# Altium schematic sheet OBC_EBI_D-Latch.SchDoc: EBI / D-Latch
size A4; SheetNumber: 7; SheetTotal: 10
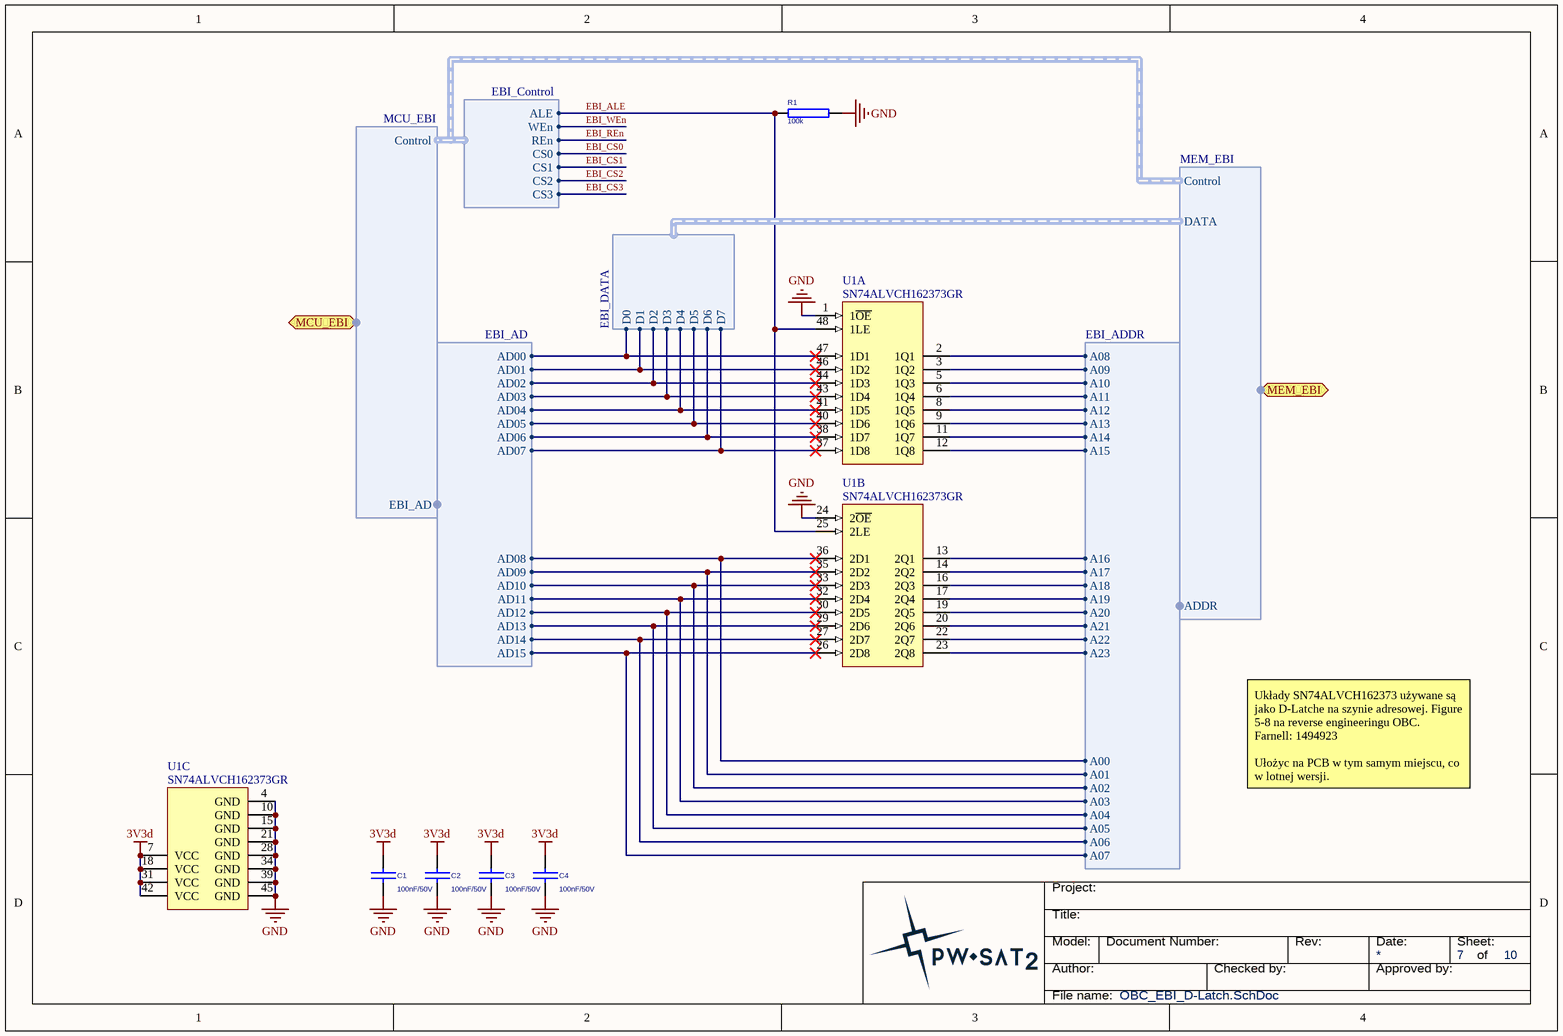
[diagram p0: OBC_EBI_D-Latch.SchDoc]

## Parts
C1  100nF/50V  [C0603]
C2  100nF/50V  [C0603]
C3  100nF/50V  [C0603]
C4  100nF/50V  [C0603]
R1  100k  [R0603]
U1  SN74ALVCH162373GR  [DGG0048A_N]  (parts A,B,C of 3)

## Ports
MCU_EBI (harness MCU_EBI), MEM_EBI (harness MEM_EBI)

## Harnesses
MCU_EBI: EBI_AD, Control
EBI_AD: AD00, AD01, AD02, AD03, AD04, AD05, AD06, AD07, AD09, AD10, AD11, AD12, AD13, AD14, AD15, AD08
MEM_EBI: DATA, ADDR, Control
EBI_ADDR: A09, A10, A11, A12, A13, A14, A15, A08, A16, A17, A18, A19, A20, A21, A22, A23, A00, A01, A02, A03, A04, A05, A06, A07
EBI_Control: ALE, WEn, REn, CS0, CS1, CS2, CS3
EBI_DATA: D6, D5, D4, D3, D2, D1, D0, D7

## Nets
3V3d: C1.1 C2.1 C3.1 C4.1 U1.7(VCC) U1.18(VCC) U1.31(VCC) U1.42(VCC)
GND: C1.2 C2.2 C3.2 C4.2 R1.1 U1.1(1~{OE}) U1.4(GND) U1.10(GND) U1.15(GND) U1.21(GND) U1.24(2~{OE}) U1.28(GND) U1.34(GND) U1.39(GND) U1.45(GND)
EBI_ALE: R1.2 U1.25(2LE) U1.48(1LE) ; harness EBI_Control.ALE
EBI_CS0: harness EBI_Control.CS0
EBI_CS1: harness EBI_Control.CS1
EBI_CS2: harness EBI_Control.CS2
EBI_CS3: harness EBI_Control.CS3
EBI_REn: harness EBI_Control.REn
EBI_WEn: harness EBI_Control.WEn
NetU1_2: U1.2(1Q1) ; harness EBI_ADDR.A08
NetU1_3: U1.3(1Q2) ; harness EBI_ADDR.A09
NetU1_5: U1.5(1Q3) ; harness EBI_ADDR.A10
NetU1_6: U1.6(1Q4) ; harness EBI_ADDR.A11
NetU1_8: U1.8(1Q5) ; harness EBI_ADDR.A12
NetU1_9: U1.9(1Q6) ; harness EBI_ADDR.A13
NetU1_11: U1.11(1Q7) ; harness EBI_ADDR.A14
NetU1_12: U1.12(1Q8) ; harness EBI_ADDR.A15
NetU1_13: U1.13(2Q1) ; harness EBI_ADDR.A16
NetU1_14: U1.14(2Q2) ; harness EBI_ADDR.A17
NetU1_16: U1.16(2Q3) ; harness EBI_ADDR.A18
NetU1_17: U1.17(2Q4) ; harness EBI_ADDR.A19
NetU1_19: U1.19(2Q5) ; harness EBI_ADDR.A20
NetU1_20: U1.20(2Q6) ; harness EBI_ADDR.A21
NetU1_22: U1.22(2Q7) ; harness EBI_ADDR.A22
NetU1_23: U1.23(2Q8) ; harness EBI_ADDR.A23
NetU1_26: U1.26(2D8) ; harness EBI_AD.AD15, harness EBI_ADDR.A07
NetU1_27: U1.27(2D7) ; harness EBI_AD.AD14, harness EBI_ADDR.A06
NetU1_29: U1.29(2D6) ; harness EBI_AD.AD13, harness EBI_ADDR.A05
NetU1_30: U1.30(2D5) ; harness EBI_AD.AD12, harness EBI_ADDR.A04
NetU1_32: U1.32(2D4) ; harness EBI_AD.AD11, harness EBI_ADDR.A03
NetU1_33: U1.33(2D3) ; harness EBI_AD.AD10, harness EBI_ADDR.A02
NetU1_35: U1.35(2D2) ; harness EBI_AD.AD09, harness EBI_ADDR.A01
NetU1_36: U1.36(2D1) ; harness EBI_AD.AD08, harness EBI_ADDR.A00
NetU1_37: U1.37(1D8) ; harness EBI_AD.AD07, harness EBI_DATA.D7
NetU1_38: U1.38(1D7) ; harness EBI_AD.AD06, harness EBI_DATA.D6
NetU1_40: U1.40(1D6) ; harness EBI_AD.AD05, harness EBI_DATA.D5
NetU1_41: U1.41(1D5) ; harness EBI_AD.AD04, harness EBI_DATA.D4
NetU1_43: U1.43(1D4) ; harness EBI_AD.AD03, harness EBI_DATA.D3
NetU1_44: U1.44(1D3) ; harness EBI_AD.AD02, harness EBI_DATA.D2
NetU1_46: U1.46(1D2) ; harness EBI_AD.AD01, harness EBI_DATA.D1
NetU1_47: U1.47(1D1) ; harness EBI_AD.AD00, harness EBI_DATA.D0

## Notes on the sheet
- Układy SN74ALVCH162373 używane są jako D-Latche na szynie adresowej. Figure 5-8 na reverse engineeringu OBC.
  Farnell: 1494923
  Ułożyc na PCB w tym samym miejscu, co w lotnej wersji.
- Title:
- Project:
- Author:
- Model:
- Document Number:
- Checked by:
- Rev:
- Date:
- Approved by:
- Sheet:
- of
- File name:

## Library data of the parts
C1-C4 = CAP: Capacitator; Voltage: 50V; Material: X7R; Value: 100nF; Farnell: 1759122; Supplier Part Number 1: 1759122; Supplier 1: Farnell
R1 = RES: Resistor; Tolerance: 1%; Farnell: 9330402; Value: 100k; Supplier Part Number 1: 9330402; Supplier 1: Farnell
U1 = SN74ALVCH162373GR: 16-Bit Transparent D-Type Latch with 3-State Outputs, DGG0048A, LARGE T&R; Manufacturer: Texas Instruments; Supplier 1: Digi-Key; DigiKey: 296-18538-1-ND; partNo: SN74ALVCH162373GR